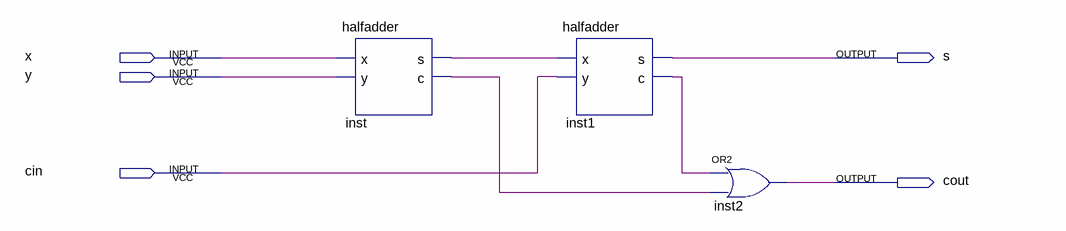
[diagram p0: schematic sheet]
// Quartus schematic fulladder.bdf as structural Verilog: 3 symbols, 5 pins
module fulladder (
  input  x,
  input  y,
  input  cin,
  output s,
  output cout
);

  wire inst1_c, inst_c, inst_s;

  halfadder inst (.x(x), .y(y), .s(inst_s), .c(inst_c));
  halfadder inst1 (.x(inst_s), .y(cin), .s(s), .c(inst1_c));
  or inst2 (cout, inst1_c, inst_c);
endmodule
